# Altium schematic sheet psram.SchDoc
size A3
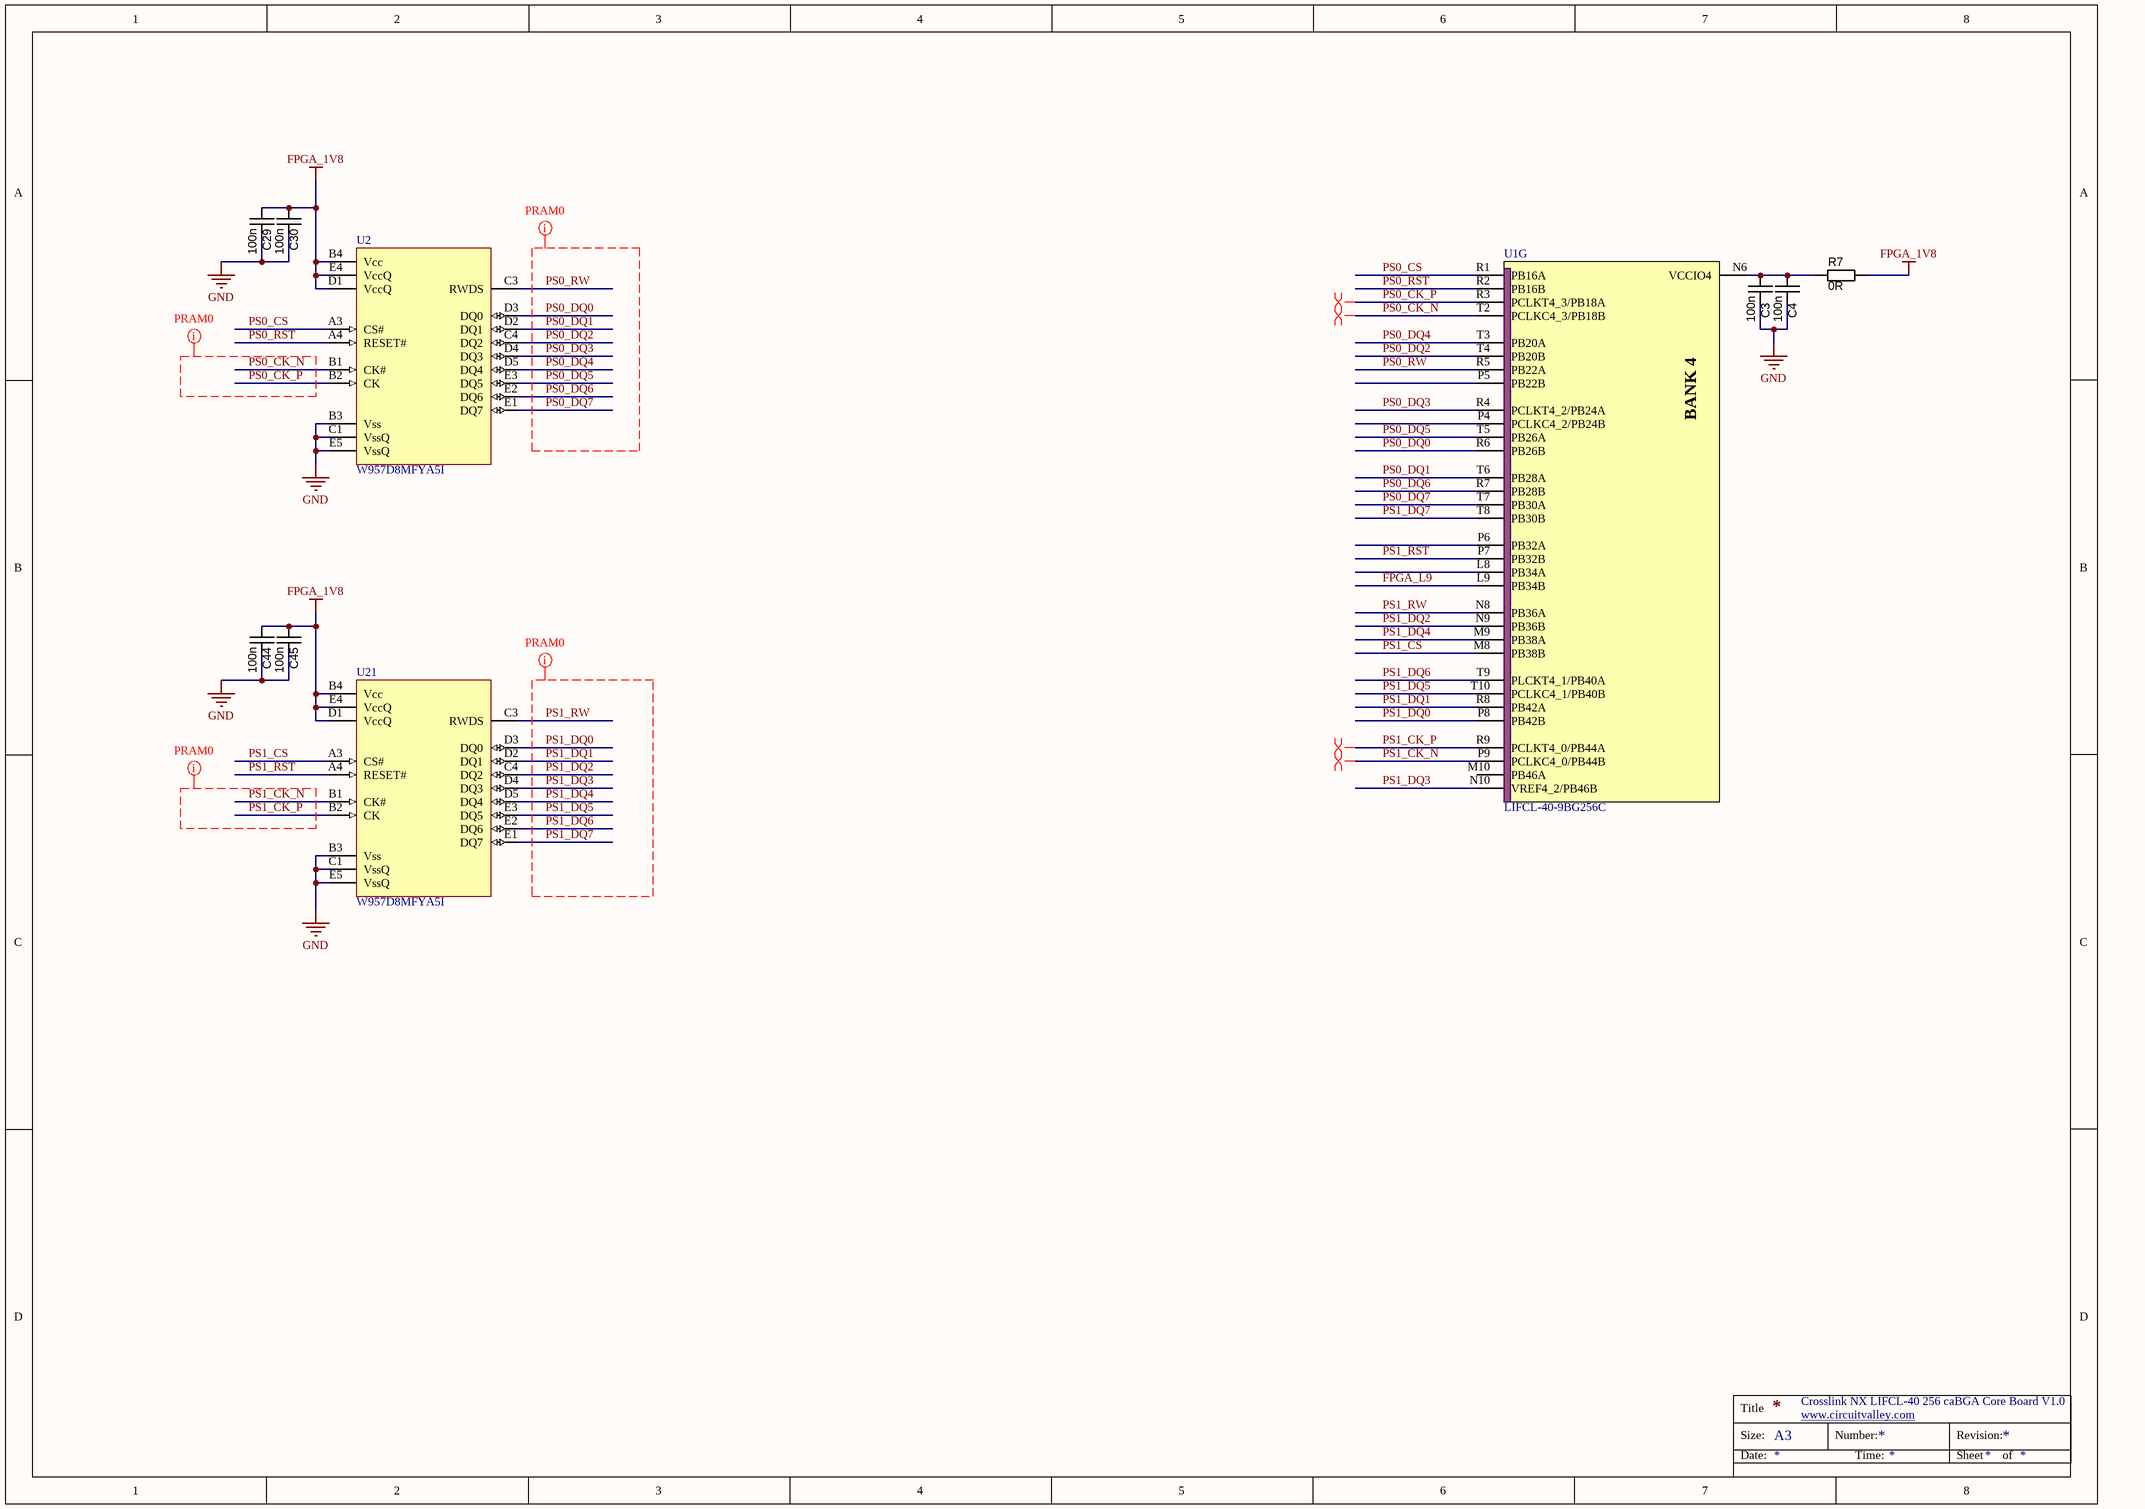
[diagram p0: psram.SchDoc]

## Parts
C3  100n  [CAPC1005N]
C4  100n  [CAPC1005N]
C29  100n  [CAPC1005N]
C30  100n  [CAPC1005N]
C44  100n  [CAPC1005N]
C45  100n  [CAPC1005N]
R7  value 0R  [RESC1005N]  (hidden comment: Thick Film)
U1  LIFCL-40-9BG256C  [Lattice_256_CABGA]  (part G of 14)
U2  W957D8MFYA5I  [TFBGA24]
U21  W957D8MFYA5I  [TFBGA24]

## Nets
FPGA_1V8: C29.2 C30.2 C44.2 C45.2 R7.2 U2.B4(Vcc) U2.D1(VccQ) U2.E4(VccQ) U21.B4(Vcc) U21.D1(VccQ) U21.E4(VccQ)
GND: C3.1 C4.1 C29.1 C30.1 C44.1 C45.1 U2.B3(Vss) U2.C1(VssQ) U2.E5(VssQ) U21.B3(Vss) U21.C1(VssQ) U21.E5(VssQ)
FPGA_L9: U1.L9(PB34B)
PS0_CK_N: U1.T2(PCLKC4_3/PB18B) U2.B1(CK#)
PS0_CK_P: U1.R3(PCLKT4_3/PB18A) U2.B2(CK)
PS0_CS: U1.R1(PB16A) U2.A3(CS#)
PS0_DQ0: U1.R6(PB26B) U2.D3(DQ0)
PS0_DQ1: U1.T6(PB28A) U2.D2(DQ1)
PS0_DQ2: U1.T4(PB20B) U2.C4(DQ2)
PS0_DQ3: U1.R4(PCLKT4_2/PB24A) U2.D4(DQ3)
PS0_DQ4: U1.T3(PB20A) U2.D5(DQ4)
PS0_DQ5: U1.T5(PB26A) U2.E3(DQ5)
PS0_DQ6: U1.R7(PB28B) U2.E2(DQ6)
PS0_DQ7: U1.T7(PB30A) U2.E1(DQ7)
PS0_RST: U1.R2(PB16B) U2.A4(RESET#)
PS0_RW: U1.R5(PB22A) U2.C3(RWDS)
PS1_CK_N: U1.P9(PCLKC4_0/PB44B) U21.B1(CK#)
PS1_CK_P: U1.R9(PCLKT4_0/PB44A) U21.B2(CK)
PS1_CS: U1.M8(PB38B) U21.A3(CS#)
PS1_DQ0: U1.P8(PB42B) U21.D3(DQ0)
PS1_DQ1: U1.R8(PB42A) U21.D2(DQ1)
PS1_DQ2: U1.N9(PB36B) U21.C4(DQ2)
PS1_DQ3: U1.N10(VREF4_2/PB46B) U21.D4(DQ3)
PS1_DQ4: U1.M9(PB38A) U21.D5(DQ4)
PS1_DQ5: U1.T10(PCLKC4_1/PB40B) U21.E3(DQ5)
PS1_DQ6: U1.T9(PLCKT4_1/PB40A) U21.E2(DQ6)
PS1_DQ7: U1.T8(PB30B) U21.E1(DQ7)
PS1_RST: U1.P7(PB32B) U21.A4(RESET#)
PS1_RW: U1.N8(PB36A) U21.C3(RWDS)
NetC3_2: C3.2 C4.2 R7.1 U1.N6(VCCIO4)

Not connected (* = marked no-connect by the designer): U1 L8(PB34A) M10(PB46A) P4(PCLKC4_2/PB24B) P5(PB22B) P6(PB32A)

## Layout directives
differential pair: PS0_CK_N, PS0_CK_P, PS1_CK_N, PS1_CK_P
net class pram0: PS0_CK_N, PS0_CK_P, PS0_DQ0, PS0_DQ1, PS0_DQ2, PS0_DQ3, PS0_DQ4, PS0_DQ5, PS0_DQ6, PS0_DQ7, PS0_RW
net class pram1: PS1_CK_N, PS1_CK_P, PS1_DQ0, PS1_DQ1, PS1_DQ2, PS1_DQ3, PS1_DQ4, PS1_DQ5, PS1_DQ6, PS1_DQ7, PS1_RW

## Notes on the sheet
- Crosslink NX LIFCL-40 256 caBGA Core Board V1.0
- www.circuitvalley.com <http://www.circuitvalley.com>
- Title
- Size:
- Date:
- A3
- Number:
- Time:
- Revision:
- Sheet
- of
- (in symbol LIFCL-40-9BG256C, part G) BANK 4

## Library data of the parts
C3 C4 C29 C30 C44 C45 = CAPC_10n_0402_16V_10%: Capacitor SMD Cer 10nF 10% 16V X7R 0402; Manufacturer 1: AVX Corporation; Manufacturer Part Number 1: 0402YC103KAT2A; Ratings: 16V; X7R; Tolerance: ±10%; Operating Temperature: -55°C ~ 125°C; Package / Case: 0402 (1005 Metric); Size / Dimension: 0.039" L x 0.020" W (1.00mm x 0.50mm); Manufacturer 2: Yageo; Manufacturer Part Number 2: CC0402KRX7R7BB103; Supplier 1: Digi-Key; Supplier Part Number 1: 478-1114-1-ND; ComponentLink1URL: http://www.avx.com/docs/Catalogs/cx7r.pdf; ComponentLink1Description: http://www.avx.com/docs/Catalogs/cx7r.pdf; Supplier 2: Digi-Key; Supplier Part Number 2: 311-1042-1-ND; ComponentLink2URL: http://www.yageo.com/documents/recent/UPY-GPHC_X7R_6.3V-to-50V_8.pdf; ComponentLink2Description: http://www.yageo.com/documents/recent/UPY-GPHC_X7R_6.3V-to-50V_8.pdf; Value: 100n
R7 = RES_3K3_0402_5%: Resistor SMD chip 3.3k Ohm 0.063W 5% 0402; Manufacturer 1: Yageo; Manufacturer Part Number 1: RC0402JR-073K3L; Ratings: 1/16 W; Package / Case: 0402 (1005 metric); Tolerance: ±5%; Material: Thick Film; Supplier 1: Digi-Key; Supplier Part Number 1: 311-3.3KJRCT-ND; ComponentLink1URL: http://www.yageo.com/documents/recent/PYu-RC0402_51_RoHS_L_6.pdf; ComponentLink1Description: http://www.yageo.com/documents/recent/PYu-RC0402_51_RoHS_L_6.pdf
U1 = LIFCL-40-9BG256C: FPGA CorsslinkNX  LIFCL-40-9BG256C
U2 U21 = W957D8MFYA5I: HyperRAM 16Mx8